# EAGLE design flight-mag3110 (EAGLE 7.4.0)
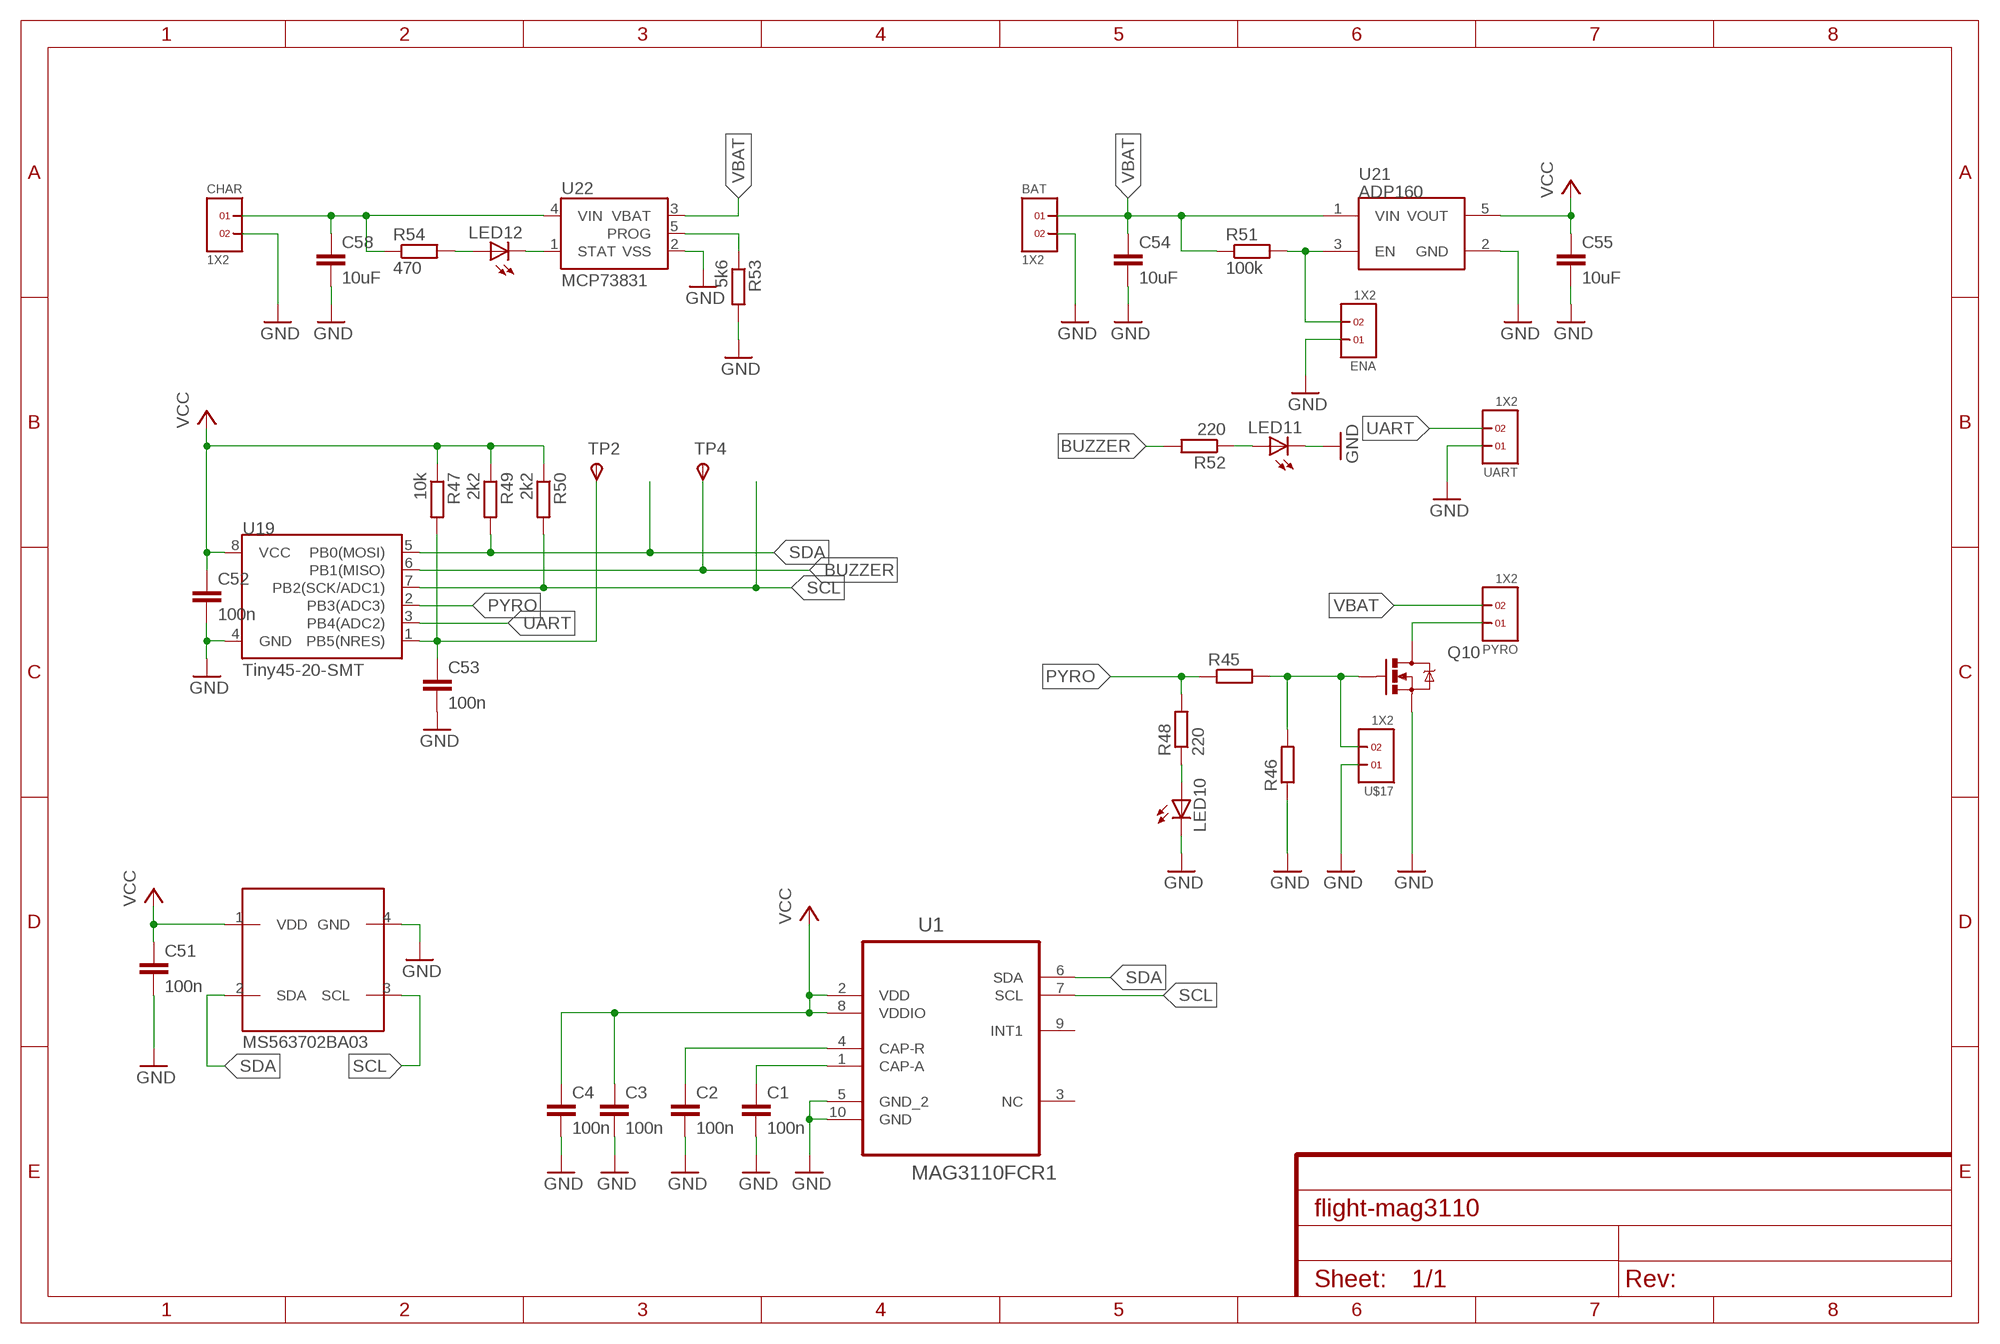
[diagram p0: schematic, sheet 1]

## Parts
BAT  1X2  [1X2]
C1  100n  C-EUC0603  [C0603]
C2  100n  C-EUC0603  [C0603]
C3  100n  C-EUC0603  [C0603]
C4  100n  C-EUC0603  [C0603]
C51  100n  C-EUC0603  [C0603]
C52  100n  C-EUC1206  [C1206]
C53  100n  C-EUC0603  [C0603]
C54  10uF  C-EUC0603  [C0603]
C55  10uF  C-EUC0603  [C0603]
C58  10uF  C-EUC0603  [C0603]
CHAR  1X2  [1X2]
ENA  1X2  [1X2]
IC2  MS563702BA03  [MS5637]
LED10  LEDCHIPLED_0805  [CHIPLED_0805]
LED11  LEDCHIPLED_0805  [CHIPLED_0805]
LED12  LEDCHIPLED_0603  [CHIPLED_0603]
PYRO  1X2  [1X2]
Q10  MOSFET-NCHANNELBSS123LT1G  [SOT23-3]
R45  R-EU_R0603  [R0603]
R46  R-EU_R0603  [R0603]
R47  10k  R-EU_R0603  [R0603]
R48  220  R-EU_R0603  [R0603]
R49  2k2  R-EU_R0603  [R0603]
R50  2k2  R-EU_R0603  [R0603]
R51  100k  R-EU_R0603  [R0603]
R52  220  R-EU_R0603  [R0603]
R53  5k6  R-EU_R0603  [R0603]
R54  470  R-EU_R0603  [R0603]
TP2  TPSB1,27  [B1,27]
TP4  TPSB1,27  [B1,27]
U1  MAG3110FCR1  [DFN200X200X90-10N]
U19  Tiny45-20-SMT  ATTINY45TINY45-20-SMT  [SO08-EIAJ]
U21  ADP160  [SOT23-5]
U22  MCP73831  [SOT23-5]
U$17  1X2  [1X2]
UART  1X2  [1X2]

## Nets
BUZZER: R52.2 TP4.TP(PP) U19.6(PB1(MISO))
ENA: ENA.2 R51.2 U21.3(EN)
GND: BAT.2 C1.2 C2.2 C3.2 C4.2 C51.2 C52.2 C53.2 C54.2 C55.2 C58.2 CHAR.2 ENA.1 IC2.4(GND) LED10.C LED11.C Q10.2(S) R46.1 R53.2 U1.5(GND_2) U1.10(GND) U19.4(GND) U21.2(GND) U22.2(VSS) U$17.1 UART.1
N$5: C1.1 U1.1(CAP-A)
N$6: C2.1 U1.4(CAP-R)
N$132: C53.1 R47.2 TP2.TP(PP) U19.1(PB5(NRES))
N$133: Q10.1(G) R45.2 R46.2 U$17.2
N$134: LED10.A R48.1
N$137: LED11.A R52.1
N$138: PYRO.1 Q10.3(D)
N$139: R53.1 U22.5(PROG)
N$140: LED12.C U22.1(STAT)
N$141: LED12.A R54.2
N$142: C58.1 CHAR.1 R54.1 U22.4(VIN)
PYRO: R45.1 R48.2 U19.2(PB3(ADC3))
SCL: IC2.3(SCL) R50.2 U1.7(SCL) U19.7(PB2(SCK/ADC1))
SDA: IC2.2(SDA) R49.2 U1.6(SDA) U19.5(PB0(MOSI))
UART: U19.3(PB4(ADC2)) UART.2
VBAT: BAT.1 C54.1 PYRO.2 R51.1 U21.1(VIN) U22.3(VBAT)
VCC: C3.1 C4.1 C51.1 C52.1 C55.1 IC2.1(VDD) R47.1 R49.1 R50.1 U1.2(VDD) U1.8(VDDIO) U19.8(VCC) U21.5(VOUT)
Unconnected: U1.3(NC) U1.9(INT1)

## Library data of the parts
BAT CHAR ENA PYRO U$17 UART = headers(2mm)(samtec):1X2
C1-C4 C51-C55 C58 = rcl:C-EU: CAPACITOR, European symbol
IC2 = freetronics-original:MS5637
LED10-LED12 = led:LED: LED OSRAM: - CHIPLED LG R971, LG N971, LY N971, LG Q971, LY Q971, LO R971, LY R971 LH N974, LH R974 LS Q976, LO Q976, LY Q976 LO Q996 - Hyper CHIPLED LW Q18S LB Q993, LB Q99A, LB R99A - SideLED LS A670, LO A670, LY A670, LG A670, LP A670 LB A673, LV A673, LT A673, LW A673 LH A674 LY A675 LS A676, LA A676, LO A676, LY A676, LW A676 LS A679, LY A679, LG A679 - Hyper Micro SIDELED® LS Y876, LA Y876, LO Y876, LY Y876 LT Y87S - SmartLED LW L88C, LW L88S LB L89C, LB L89S, LG L890 LS L89K, LO L89K, LY L89K LS L896, LA L896, LO L896, LY L896 - TOPLED LS T670, LO T670, LY T670, LG T670, LP T670 LSG T670, LSP T670, LSY T670, LOP T670, LYG T670 LG T671, LOG T671, LSG T671 LB T673, LV T673, LT T673, LW T673 LH T674 LS T676, LA T676, LO T676, LY T676, LB T676, LH T676, LSB T676, LW T676 LB T67C, LV T67C, LT T67C, LS T67K, LO T67K, LY T67K, LW E67C LS E67B, LA E67B, LO E67B, LY E67B, LB E67C, LV E67C, LT E67C LW T67C LS T679, LY T679, LG T679 LS T770, LO T770, LY T770, LG T770, LP T770 LB T773, LV T773, LT T773, LW T773 LH T774 LS E675, LA E675, LY E675, LS T675 LS T776, LA T776, LO T776, LY T776, LB T776 LHGB T686 LT T68C, LB T68C - Hyper Mini TOPLED® LB M676 - Mini TOPLED Santana® LG M470 LS M47K, LO M47K, LY M47K Source: http://www.osram.convergy.de LUXEON: - LUMILED® LXK2-PW12-R00, LXK2-PW12-S00, LXK2-PW14-U00, LXK2-PW14-V00 LXK2-PM12-R00, LXK2-PM12-S00, LXK2-PM14-U00 LXK2-PE12-Q00, LXK2-PE12-R00, LXK2-PE12-S00, LXK2-PE14-T00, LXK2-PE14-U00 LXK2-PB12-K00, LXK2-PB12-L00, LXK2-PB12-M00, LXK2-PB14-N00, LXK2-PB14-P00, LXK2-PB14-Q00 LXK2-PR12-L00, LXK2-PR12-M00, LXK2-PR14-Q00, LXK2-PR14-R00 LXK2-PD12-Q00, LXK2-PD12-R00, LXK2-PD12-S00 LXK2-PH12-R00, LXK2-PH12-S00 LXK2-PL12-P00, LXK2-PL12-Q00, LXK2-PL12-R00 Source: www.luxeon.com KINGBRIGHT: KA-3528ASYC Source: www.kingbright.com
Q10 = SparkFun-DiscreteSemi:MOSFET-NCHANNEL: Common NMOSFET Parts MFG P/N Store ID Prod ID FDD8780 TRANS-09984 SI7820DN TRANS-11055 FDS6630A IC-08089 2N7002PW TRANS-11151 FQP30N06L COM-10213 TRANS-10060 BSS123LT1G TRANS-08345 BSS138 TRANS-00830 BS170 2N7000; PROD_ID: TRANS-08345
R45-R47 R49-R51 R53 R54 = rcl:R-EU_: RESISTOR, European symbol
R48 R52 = resistor:R-EU_: RESISTOR, European symbol
TP2 TP4 = testpad:TPS: TEST PIN
U1 = gps_tracker:MAG3110FCR1: MAGNETOMETER, 3AXIS, I2C, 80HZ,DFN-10; MPN: MAG3110FCR1; OC_FARNELL: 2080492; OC_NEWARK: 07W3591; PACKAGE: DFN-10; SUPPLIER: FREESCALE SEMICONDUCTOR
U19 = SparkFun-DigitalIC:ATTINY45: Atmel 8-pin 2/4/8kB flash uC; PROD_ID: IC-08922
U21 = SparkFun-PowerIC:ADP160: Nanopower LDO Iq less than 1uA for low Iload; FARNELL: 2510377; PROD_ID: VREG-11306
U22 = SparkFun-PowerIC:MCP73831: Miniature single cell, fully integrated Li-Ion, Li-polymer charge management controller http://ww1.microchip.com/downloads/en/DeviceDoc/20001984g.pdf IC-09995; FARNELL: 1834892; PROD_ID: IC-09995

## Board
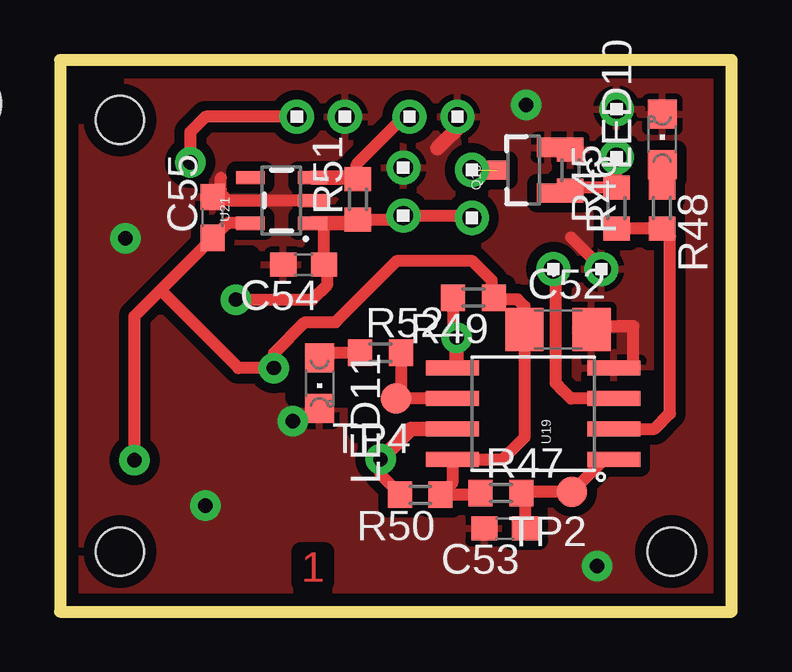
[diagram p1: board, top side]
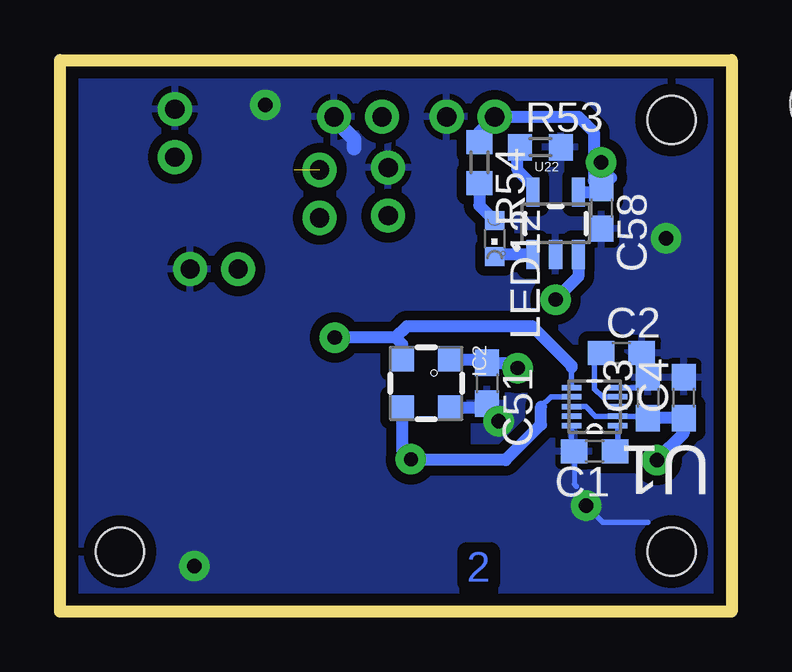
[diagram p2: board, bottom side, seen from below]

Size 28 x 23 mm. Coordinates in mm from the lower left corner, seen from the top.
Outline: 28,0 28,23 0,23 0,0 28,0
Copper layers (1*16): Top 0.035mm / dielectric 1.5mm / Bottom 0.035mm
Design rules "default *": minimum track width 10mil, minimum drill 24mil, track to track 8mil, track to pad 8mil, pad to pad 8mil, via to via 8mil, smd to smd 8mil, copper to edge 20mil, drill to drill 8mil, minimum pad ring 10mil, minimum via ring 8mil, stop-mask expansion 4mil, vias tented up to drill 0mil, thermal gap 10mil
Holes 2 mm at 25.5,2.5 2.5,2.5 2.5,20.5
Holes 3 mm at -4.32,2.6 -3.95,21.18 33.2,21.18 33.2,2.6
tRestrict: area 24.3,8.9 to 25,9.7; area 12.4,7.4 to 13.5,10; area 7.2,13.7 to 7.9,14.9; area 9.8,8.9 to 12.4,9.7
bRestrict: area 11.5,8.3 to 14,10.8; area 11.3,6.7 to 12.4,7.8; area 4.6,9.7 to 5,10.4

### Footprints (pad centres in the part's own frame; a part is rotated, then mirrored left to right if it is on the bottom)
1X2 = drill 0.8 pad 1.422: 1 0,0; 2 2,0
C0603 = smd 1.1 x 1: 1 -0.85,0; 2 0.85,0
C1206 = smd 1.6 x 1.8: 1 -1.4,0; 2 1.4,0
MS5637 = smd 1 x 1: 1 -1,1; 2 -1,-1; 3 1,-1; 4 1,1
CHIPLED_0805 = smd 1.2 x 1.2: A 0,-1.05; C 0,1.05
CHIPLED_0603 = smd 0.8 x 0.8: A 0,-0.75; C 0,0.75
SOT23-3 = smd 0.8 x 0.9: 1 -0.95,-1; 2 0.95,-1; 3 0,1.1
R0603 = smd 1 x 1.1: 1 -0.85,0; 2 0.85,0
B1,27 = smd 1.27 x 1.27: TP 0,0
DFN200X200X90-10N = smd 0.813 x 0.229: 1 -0.965,0.787; 2 -0.965,0.406; 3 -0.965,0; 4 -0.965,-0.406; 5 -0.965,-0.787; 6 0.965,-0.787; 7 0.965,-0.406; 8 0.965,0; 9 0.965,0.406; 10 0.965,0.787
SO08-EIAJ = smd 0.61 x 2.21: 1 -1.905,-3.378; 2 -0.635,-3.378; 3 0.635,-3.378; 4 1.905,-3.378; 5 1.905,3.353; 6 0.635,3.353; 7 -0.635,3.353; 8 -1.905,3.353
SOT23-5 = smd 0.55 x 1.2: 1 -0.95,-1.3; 2 0,-1.3; 3 0.95,-1.3; 4 0.95,1.3; 5 -0.95,1.3

### Placement (x,y rotation side)
BAT  14.32,16.51 90 top
C1  5.71,6.69 180 bottom
C2  4.6,10.77 0 bottom
C3  3.48,8.92 90 bottom
C4  1.99,8.92 90 bottom
C51  10.19,9.52 270 bottom
C52  20.77,11.76 0 top
C53  18.55,3.47 180 top
C54  10.16,14.47 180 top
C55  6.37,16.43 90 top
C58  5.43,16.82 270 bottom
CHAR  9.88,20.63 0 top
ENA  16.57,20.63 180 top
IC2  12.73,9.52 270 bottom
LED10  25.11,19.68 0 top
LED11  10.83,9.52 180 top
LED12  9.88,15.55 180 bottom
PYRO  17.17,18.41 270 top
Q10  19.33,18.4 90 top
R45  23.21,16.83 90 top
R46  21.28,18.4 270 top
R47  18.38,4.94 0 top
R48  25.1,16.82 270 top
R49  17.24,13.09 180 top
R50  15.02,4.87 180 top
R51  12.42,17.19 90 top
R52  13.37,10.79 0 top
R53  7.97,19.36 0 bottom
R54  10.51,18.72 270 bottom
TP2  21.35,5 180 top
TP4  14,8.89 180 top
U1  5.71,8.54 180 bottom
U19  19.72,8.25 90 top
U21  9.24,17.14 90 top
U22  7.34,16.18 0 bottom
U$17  23.21,20.95 270 top
UART  22.57,14.28 180 top

### Tracks (layer width: path | path; a pad name or v marks a point on that pad's centre or on a via)
BUZZER
  Top 0.5: U19.6 TP4.TP 14.22,9.1 R52.2
ENA
  Top 0.5: 12.37,18.09 12.37,18.66 14.03,20.32 14.26,20.32 ENA.2
  Top 0.61: U21.3 12.37,18.09 R51.2
GND  (via drill 0.6 pad 1.27)
  Top 0.5: U21.2 7.01,17.14 6.7,17.45 6.7,17.61 | 6.7,17.61 C55.2 | 6.7,17.61 6.7,18.09 | U19.4 23.91,10.15 23.91,11.89 22.17,11.89 C52.2 | 22.43,14.12 22.43,14.49 21.31,15.6
  Top 0.61: 15.74,19.32 16.86,20.43
  Bottom 0.2: 3.92,9.33 C3.2 | 6.68,6.8 C1.2 6.56,5.31 6.45,5.2
  Bottom 0.225: U1.5 3.92,9.33 | U1.10 6.68,6.8
  Bottom 0.23: 3.48,3.71 5.37,3.71 v6.07,4.41
  Bottom 0.5: IC2.4 10.34,8.52 C51.2
  Bottom 0.61: 15.74,19.32 15.74,19.69 16.86,20.8
  other vias: 9.72,7.93 2.72,15.56 22.4,1.9 19.44,21.13
  pour Top (isolate 0.406): -0.57,-0.32 -0.57,24.21 28.34,24.21 28.34,-0.32
  pour Bottom (isolate 0.406): 28.29,0 28.61,24.44 -0.6,24.44 -0.29,0
N$5
  Bottom 0.2: 4.74,6.8 C1.1
  Bottom 0.225: U1.1 4.74,6.8
N$6
  Bottom 0.225: U1.4 5.37,8.95 5.71,9.29 5.71,10.51 C2.1
N$132
  Top 0.5: C53.1 19.4,4.94 R47.2 19.29,5 TP2.TP 22.7,6.34 U19.1
N$133
  Top 0.5: U$17.2 R45.2 21.4,17.68 R46.2
  Top 0.61: Q10.1 21.18,17.45 R46.2
N$134
  Top 0.5: R48.1 LED10.A
N$137
  Top 0.5: LED11.A 11.05,10.79 R52.1
N$138  (1 unrouted)
N$139
  Bottom 0.5: U22.5 8.29,17.77 8.92,18.41 8.92,19.26 R53.1
N$140
  Bottom 0.5: U22.1 9.79,14.88 LED12.C
N$141
  Bottom 0.5: R54.2 10.51,16.93 LED12.A
N$142  (via drill 0.6 pad 1.27)
  Top 0.5: CHAR.1 6.07,20.63 5.43,19.99 v5.43,18.72
  Bottom 0.5: U22.4 5.62,17.48 C58.1 | R54.1 10.51,19.99 CHAR.1 6.38,20.63 5.75,19.99 5.75,17.99 C58.1 | 5.01,18.09 C58.1
PYRO
  Top 0.5: 25.2,15.87 R48.2 | R48.2 R45.1 | U19.2 24.79,7.62 25.43,8.25 25.43,15.64 R48.2
SCL  (via drill 0.6 pad 1.27)
  Top 0.5: R50.2 14.17,4.91 13.37,5.71 v13.37,6.34
  Top 0.61: U19.7 14.64,7.62 v13.37,6.34
  Bottom 0.225: U1.7 7.53,8.95 7.94,8.54
  Bottom 0.5: IC2.3 13.73,6.71 v13.37,6.34 13.34,6.32 9.42,6.32 7.94,7.8 7.94,8.54
SDA  (via drill 0.6 pad 1.27)
  Top 0.3: 16.54,10.26 U19.5
  Top 0.5: R49.2 16.39,11.57 v16.54,11.43
  Top 0.61: 16.54,10.26 v16.54,11.43
  Bottom 0.225: U1.6 6.68,10.18
  Bottom 0.5: IC2.2 13.73,11.15 14,11.43 | 14,11.43 v16.54,11.43 | 6.68,10.18 6.68,10.25 8.31,11.89 13.54,11.89 14,11.43
UART
  Top 0.5: U19.3 21.3,8.88 20.98,9.2 | 20.98,9.2 | 20.98,9.2 20.67,9.52 20.67,13.87 UART.2
VBAT  (via drill 0.6 pad 1.27)
  Top 0.5: R51.1 14.15,16.34 BAT.1 17.08,16.51 PYRO.2 | 11.14,16.19 11.01,16.06 C54.1 11.15,14.33 11.15,13.64 10.51,13.01 v7.34,13.01
  Top 0.61: U21.1 11.14,16.19 12.28,16.19 R51.1
  Bottom 0.5: U22.3 6.39,13.96 v7.34,13.01
VCC  (via drill 0.6 pad 1.27)
  Top 0.5: U21.5 7.03,16.19 7.01,16.21 C55.1 | R47.1 17.53,4.87 R50.1 16.36,5.36 U19.8 18.45,6.34 19.37,7.26 C52.1 19.37,12.73 19.08,13.02 18.16,13.02 R49.1 18,13.18 18,13.81 17.2,14.61 14.03,14.61 11.49,12.06 10.22,12.06 8.92,10.77 v8.92,10.15 7.44,10.15 4.19,13.4 | C55.1 6.37,15.55 | v3.11,6.32 3.11,12.32 4.19,13.4 | 4.19,13.4 C55.1 | 6.08,15.29 C55.1
  Bottom 0.2: 3.55,8.14 C3.1
  Bottom 0.225: 3.55,8.14 U1.2 5.68,8.14 6.08,8.54 U1.8
  Bottom 0.5: IC2.1 10.34,10.52 C51.1 9.14,10.37 v8.92,10.15 | v3.11,6.32 1.99,7.43 C4.1 C3.1

### Text on the board
Top: 1
Bottom: 2